# Altium project LinuxstampII.PrjPCB
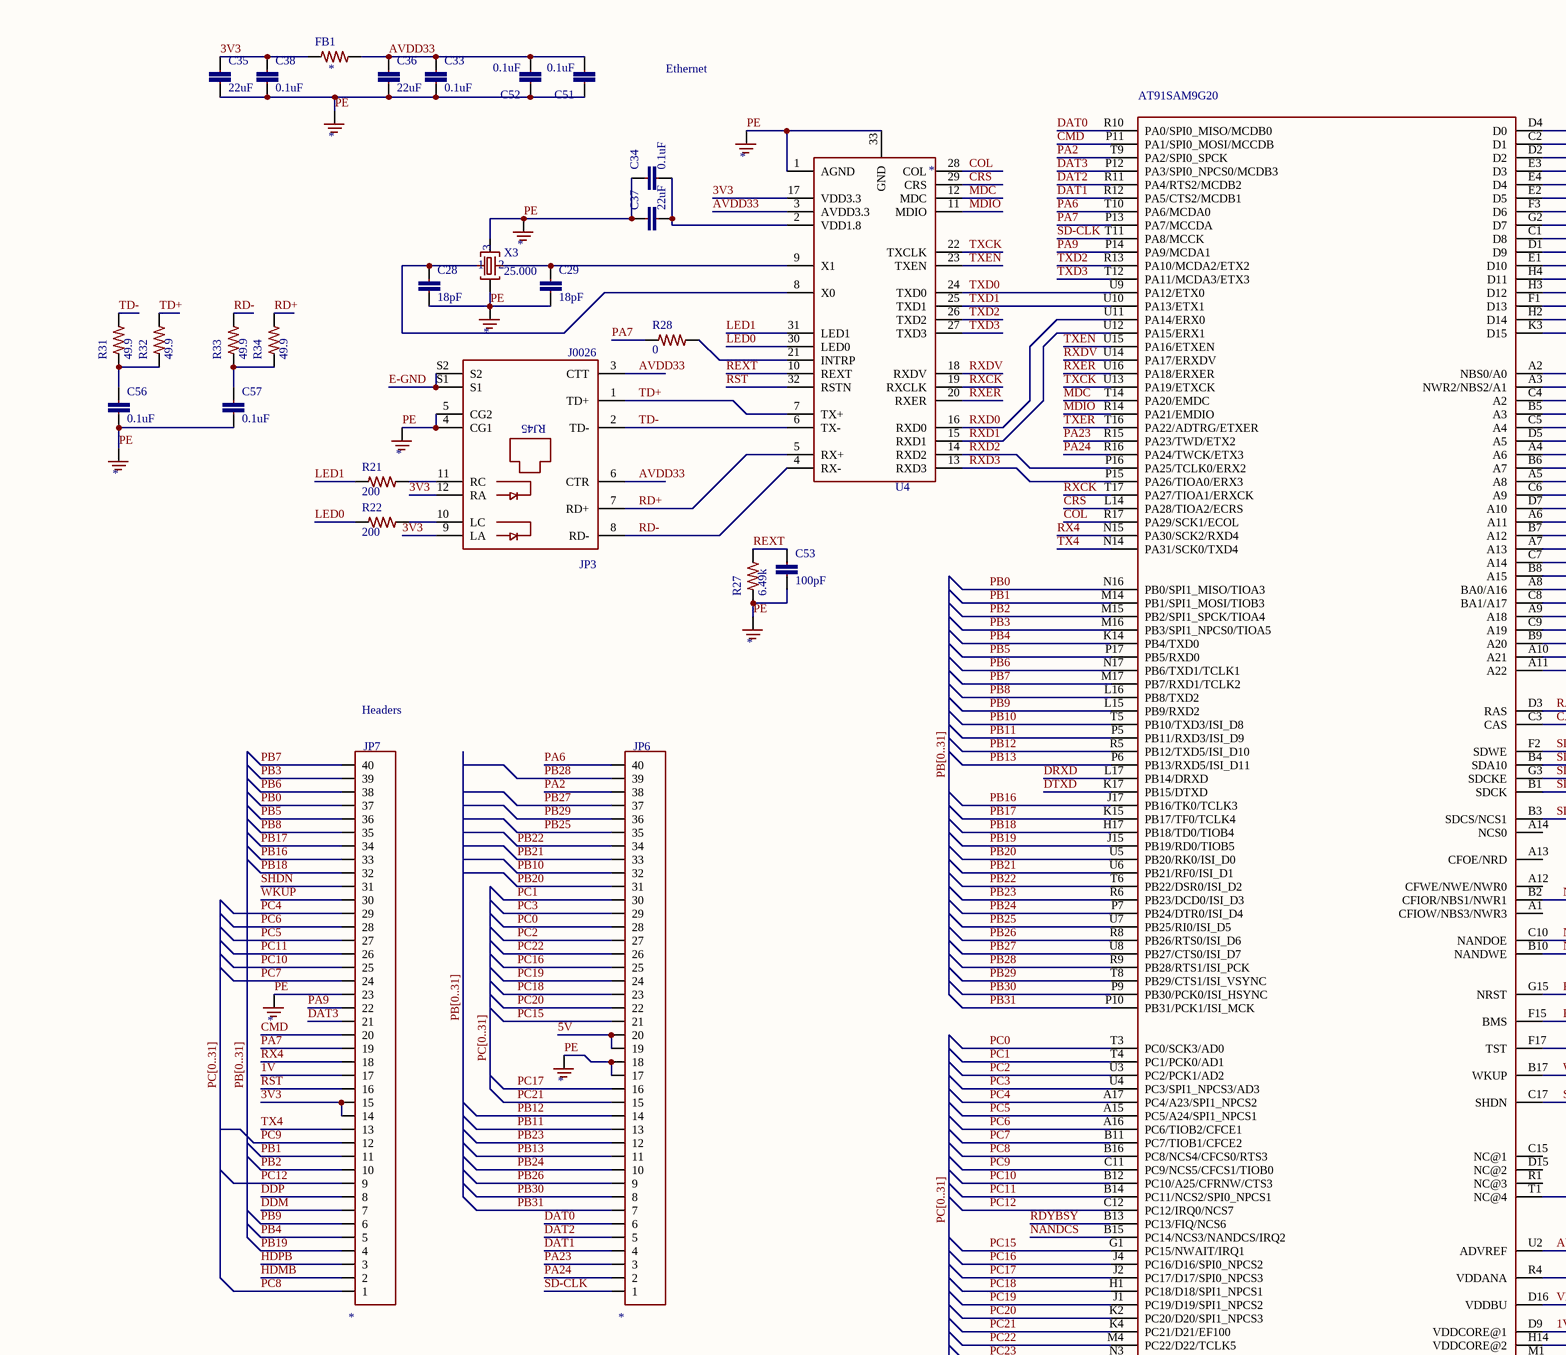
[diagram p0: ls2_101_1.SchDoc, top left]
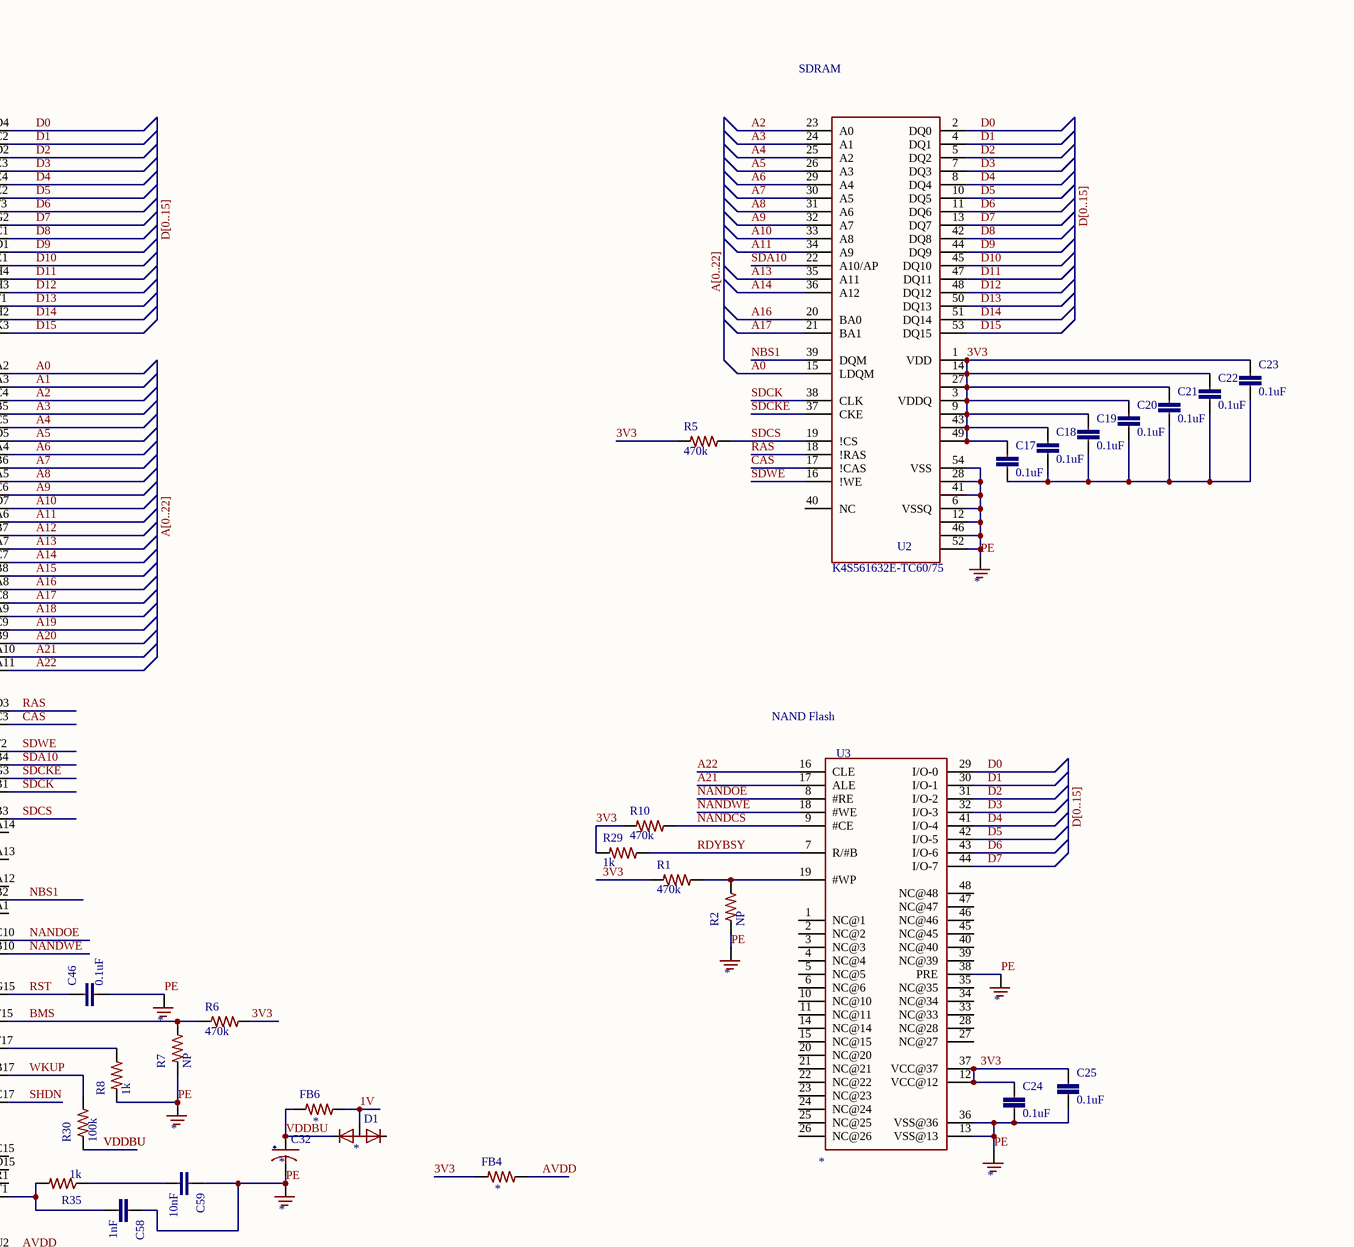
[diagram p1: ls2_101_1.SchDoc, top right]
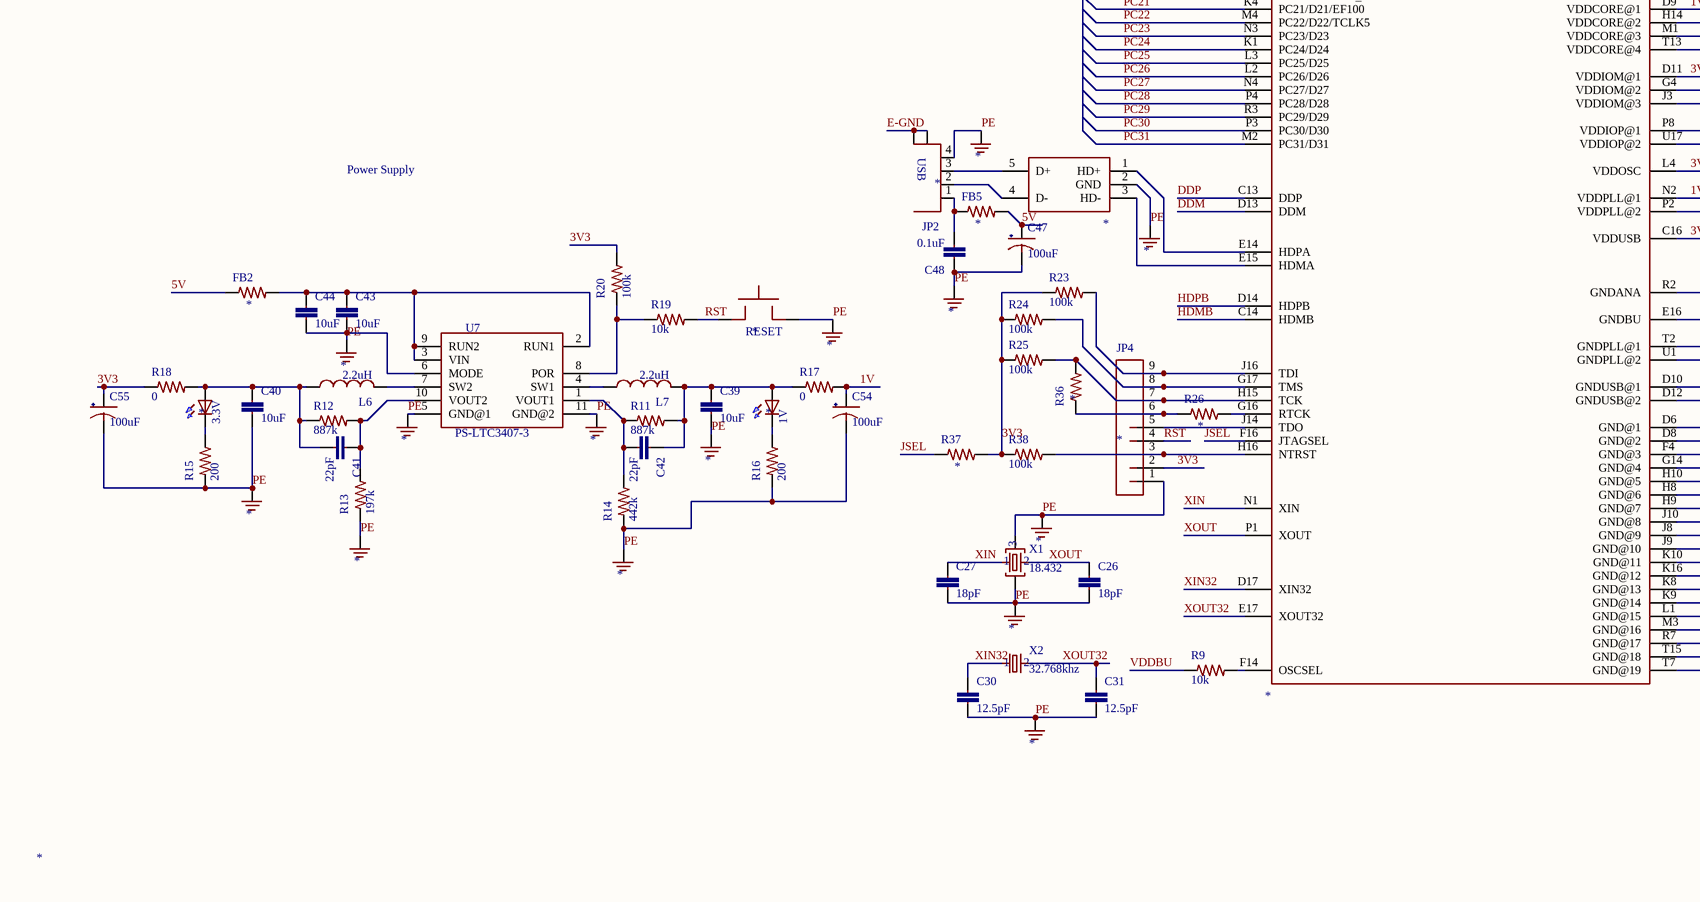
[diagram p2: ls2_101_1.SchDoc, bottom left]
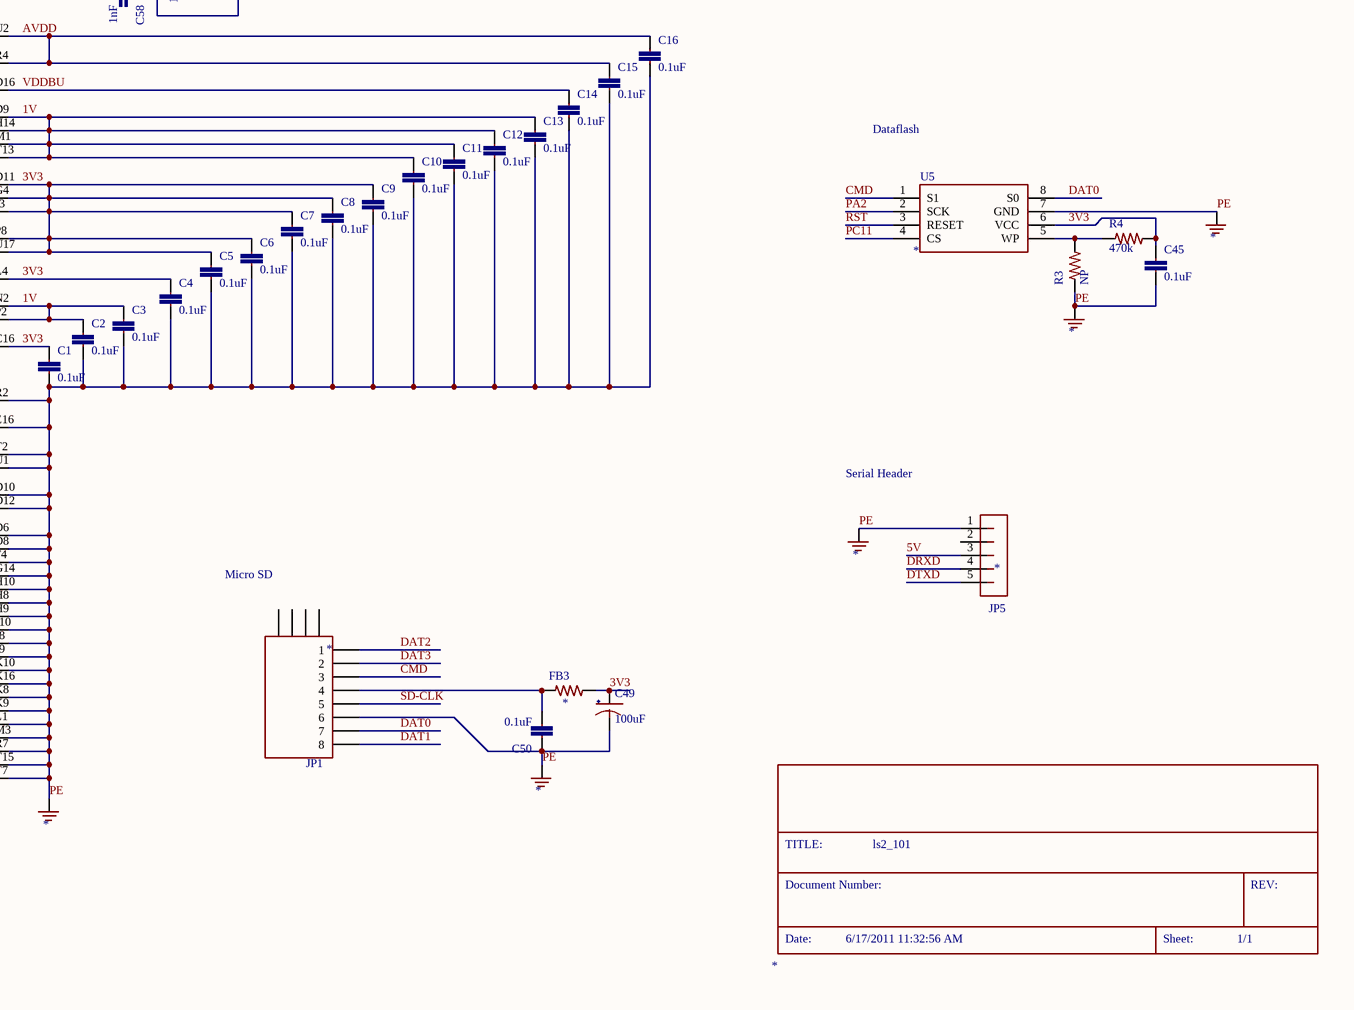
[diagram p3: ls2_101_1.SchDoc, bottom right]
1 sheet, 162 parts. Net scope: global (net labels, ports and power ports of the same name join across sheets).

## Sheet ls2_101_1.SchDoc
size 559 x 432 mm

### Parts
1V  *  [CHIP-LED0603]
3.3V  *  [CHIP-LED0603]
C1  0.1uF  [0402]
C2  0.1uF  [0402]
C3  0.1uF  [0402]
C4  0.1uF  [0402]
C5  0.1uF  [0402]
C6  0.1uF  [0402]
C7  0.1uF  [0402]
C8  0.1uF  [0402]
C9  0.1uF  [0402]
C10  0.1uF  [0402]
C11  0.1uF  [0402]
C12  0.1uF  [0402]
C13  0.1uF  [0402]
C14  0.1uF  [0402]
C15  0.1uF  [0402]
C16  0.1uF  [0402]
C17  0.1uF  [0402]
C18  0.1uF  [0402]
C19  0.1uF  [0402]
C20  0.1uF  [0402]
C21  0.1uF  [0402]
C22  0.1uF  [0402]
C23  0.1uF  [0402]
C24  0.1uF  [0402]
C25  0.1uF  [0402]
C26  18pF  [0402]
C27  18pF  [0402]
C28  18pF  [0402]
C29  18pF  [0402]
C30  12.5pF  [0402]
C31  12.5pF  [0402]
C32  *  [E3,5-8]
C33  0.1uF  [0402]
C34  0.1uF  [0402]
C35  22uF  [C0805K]
C36  22uF  [C0805K]
C37  22uF  [C0805K]
C38  0.1uF  [0402]
C39  10uF  [C0805K]
C40  10uF  [C0805K]
C41  22pF  [0402]
C42  22pF  [0402]
C43  10uF  [C0805K]
C44  10uF  [C0805K]
C45  0.1uF  [0402]
C46  0.1uF  [0402]
C47  100uF  [C/6032-28R]
C48  0.1uF  [0402]
C49  100uF  [C/6032-28R]
C50  0.1uF  [0402]
C51  0.1uF  [0402]
C52  0.1uF  [0402]
C53  100pF  [0402]
C54  100uF  [C/6032-28R]
C55  100uF  [C/6032-28R]
C56  0.1uF  [0402]
C57  0.1uF  [0402]
C58  1nF  [0402]
C59  10nF  [0402]
D1  *  [SOT23]
FB1  *  [0402]
FB2  *  [0402]
FB3  *  [0402]
FB4  *  [0402]
FB5  *  [0402]
FB6  *  [0402]
FRAME1  *  (parts A,B of 2)
JP1  *  [CON-MICRO-SD]
JP2  *  [PN87520]
JP3  J0026  [PJ-J0]
JP4  *  [MA09-1]
JP5  *  [MA05-1]
JP6  *  [CON-BERGSTACK-40]
JP7  *  [CON-BERGSTACK-40]
L6  2.2uH  [L1812]
L7  2.2uH  [L1812]
R1  470k  [0402]
R2  NP  [0402]
R3  NP  [0402]
R4  470k  [0402]
R5  470k  [0402]
R6  470k  [0402]
R7  NP  [0402]
R8  1k  [0402]
R9  10k  [0402]
R10  470k  [0402]
R11  887k  [0402]
R12  887k  [0402]
R13  197k  [0402]
R14  442k  [0402]
R15  200  [0402]
R16  200  [0402]
R17  0  [0402]
R18  0  [0402]
R19  10k  [0402]
R20  100k  [0402]
R21  200  [0402]
R22  200  [0402]
R23  100k  [0402]
R24  100k  [0402]
R25  100k  [0402]
R26  *  [0402]
R27  6.49k  [0402]
R28  0  [0402]
R29  1k  [0402]
R30  100k  [0402]
R31  49.9  [0402]
R32  49.9  [0402]
R33  49.9  [0402]
R34  49.9  [0402]
R35  1k  [0402]
R36  *  [0402]
R37  *  [0402]
R38  100k  [0402]
RESET  *  [SWITCH-6X3.5]
SUPPLY1  *
SUPPLY2  *
SUPPLY3  *
SUPPLY4  *
SUPPLY5  *
SUPPLY6  *
SUPPLY7  *
SUPPLY8  *
SUPPLY9  *
SUPPLY10  *
SUPPLY11  *
SUPPLY12  *
SUPPLY13  *
SUPPLY14  *
SUPPLY15  *
SUPPLY16  *
SUPPLY17  *
SUPPLY18  *
SUPPLY19  *
SUPPLY20  *
SUPPLY21  *
SUPPLY22  *
SUPPLY23  *
SUPPLY24  *
SUPPLY25  *
SUPPLY26  *
SUPPLY27  *
SUPPLY28  *
SUPPLY29  *
SUPPLY30  *
SUPPLY31  *
SUPPLY32  *
SUPPLY33  *
SUPPLY34  *
SUPPLY35  *
U1  *  [LFBGA-217]
U2  K4S561632E-TC60/75  [TSOP54]
U3  *  [TSOP48]
U4  *  [MLF32]
U5  *  [CASON-8]
U6  *  [SOT323-5]
U7  PS-LTC3407-3  [DFN-10]
X1  18.432  [CRYSTAL-3.2-2.5]
X2  32.768khz  [MM20SS]
X3  25.000  [CRYSTAL-3.2-2.5]

### Nets
1V: C2.1 C3.1 C10.1 C11.1 C12.1 C13.1 C54.+ D1.3(A) FB6.2 JP7.17 R17.2 U1.D9(VDDCORE@1) U1.H14(VDDCORE@2) U1.M1(VDDCORE@3) U1.N2(VDDPLL@1) U1.P2(VDDPLL@2) U1.T13(VDDCORE@4)
3V3: C1.1 C4.1 C5.1 C6.1 C7.1 C8.1 C9.1 C17.1 C18.1 C19.1 C20.1 C21.1 C22.1 C23.1 C24.1 C25.1 C35.1 C38.1 C45.1 C49.+ C55.+ FB1.1 FB3.2 FB4.1 JP3.9(LA) JP3.12(RA) JP4.2 JP7.14 JP7.15 R1.1 R4.2 R5.1 R6.2 R10.1 R18.1 R20.2 R23.1 R24.1 R25.1 R29.1 R37.2 R38.1 U1.C16(VDDUSB) U1.D11(VDDIOM@1) U1.G4(VDDIOM@2) U1.J3(VDDIOM@3) U1.L4(VDDOSC) U1.P8(VDDIOP@1) U1.U17(VDDIOP@2) U2.1(VDD) U2.3(VDDQ) U2.9(VDDQ@9) U2.14(VDD@14) U2.27(VDD@27) U2.43(VDDQ@43) U2.49(VDDQ@49) U3.12(VCC@12) U3.37(VCC@37) U4.17(VDD3.3) U5.6(VCC)
5V: C47.+ FB2.1 FB5.2 JP5.3 JP6.19 JP6.20
A0: U1.A2(NBS0/A0) U2.15(LDQM)
A1: U1.A3(NWR2/NBS2/A1)
A2: U1.C4(A2) U2.23(A0)
A3: U1.B5(A3) U2.24(A1)
A4: U1.C5(A4) U2.25(A2)
A5: U1.D5(A5) U2.26(A3)
A6: U1.A4(A6) U2.29(A4)
A7: U1.B6(A7) U2.30(A5)
A8: U1.A5(A8) U2.31(A6)
A9: U1.C6(A9) U2.32(A7)
A10: U1.D7(A10) U2.33(A8)  [also labelled A[0..22]]
A11: U1.A6(A11) U2.34(A9)
A12: U1.B7(A12)
A13: U1.A7(A13) U2.35(A11)
A14: U1.C7(A14) U2.36(A12)
A15: U1.B8(A15)
A16: U1.A8(BA0/A16) U2.20(BA0)
A17: U1.C8(BA1/A17) U2.21(BA1)
A18: U1.A9(A18)
A19: U1.C9(A19)
A20: U1.B9(A20)
A21: U1.A10(A21) U3.17(ALE)
A22: U1.A11(A22) U3.16(CLE)
AVDD: C15.1 C16.1 FB4.2 U1.R4(VDDANA) U1.U2(ADVREF)
AVDD33: C33.1 C36.1 C51.2 C52.2 FB1.2 JP3.3(CTT) JP3.6(CTR) U4.3(AVDD3.3)
BMS: R6.1 R7.2 U1.F15(BMS)
CAS: U1.C3(CAS) U2.17(!CAS)
CMD: JP1.3 JP7.20 U1.P11(PA1/SPI0_MOSI/MCCDB) U5.1(S1)
COL: U1.R17(PA29/SCK1/ECOL) U4.28(COL)
CRS: U1.L14(PA28/TIOA2/ECRS) U4.29(CRS)
D0: U1.D4(D0) U2.2(DQ0) U3.29(I/O-0)
D1: U1.C2(D1) U2.4(DQ1) U3.30(I/O-1)
D2: U1.D2 U1.E2(D5) U1.F3(D6) U2.5(DQ2) U2.10(DQ5) U2.11(DQ6) U3.31(I/O-2) U3.42(I/O-5) U3.43(I/O-6)  [also labelled D5, D6, D[0..15]]
D3: U1.E3(D3) U2.7(DQ3) U3.32(I/O-3)
D4: U1.E4(D4) U2.8(DQ4) U3.41(I/O-4)
D7: U1.G2(D7) U2.13(DQ7) U3.44(I/O-7)
D8: U1.C1(D8) U2.42(DQ8)
D9: U1.D1(D9) U2.44(DQ9)
D10: U1.E1(D10) U2.45(DQ10)
D11: U1.H4(D11) U2.47(DQ11)
D12: U1.H3(D12) U2.48(DQ12)
D13: U1.F1(D13) U2.50(DQ13)
D14: U1.H2(D14) U2.51(DQ14)
D15: U1.K3(D15) U2.53(DQ15)
DAT0: JP1.7 JP6.6 U1.R10(PA0/SPI0_MISO/MCDB0) U5.8(S0)
DAT1: JP1.8 JP6.4 U1.R12(PA5/CTS2/MCDB1)
DAT2: JP1.1 JP6.5 U1.R11(PA4/RTS2/MCDB2)
DAT3: JP1.2 JP7.21 U1.P12(PA3/SPI0_NPCS0/MCDB3)
DDM: JP7.7 U1.D13(DDM)
DDP: JP7.8 U1.C13(DDP)
DRXD: JP5.4 U1.L17(PB14/DRXD)
DTXD: JP5.5 U1.K17(PB15/DTXD)
E-GND: JP2.G1 JP2.G2 JP3.S1 JP3.S2
HDMB: JP7.2 U1.C14(HDMB)
HDPB: JP7.3 U1.D14(HDPB)
JSEL: R37.1 U1.F16(JTAGSEL)
LED0: R22.1 U4.30(LED0)
LED1: R21.1 U4.31(LED1)
MDC: U1.T14(PA20/EMDC) U4.12(MDC)
MDIO: U1.R14(PA21/EMDIO) U4.11(MDIO)
NANDCS: R10.2 U1.B15(PC14/NCS3/NANDCS/IRQ2) U3.9(#CE)
NANDOE: U1.C10(NANDOE) U3.8(#RE)
NANDWE: U1.B10(NANDWE) U3.18(#WE)
NBS1: U1.B2(CFIOR/NBS1/NWR1) U2.39(DQM)
PA2: JP6.38 U1.T9(PA2/SPI0_SPCK) U5.2(SCK)
PA6: JP6.40 U1.T10(PA6/MCDA0)
PA7: JP7.19 R28.1 U1.P13(PA7/MCCDA)
PA9: JP7.22 U1.P14(PA9/MCDA1)
PA23: JP6.3 U1.R15(PA23/TWD/ETX2)
PA24: JP6.2 U1.R16(PA24/TWCK/ETX3)
PB0: JP7.37 U1.N16(PB0/SPI1_MISO/TIOA3)
PB1: JP7.11 U1.M14(PB1/SPI1_MOSI/TIOB3)
PB2: JP7.10 U1.M15(PB2/SPI1_SPCK/TIOA4)
PB3: JP7.39 U1.M16(PB3/SPI1_NPCS0/TIOA5)
PB4: JP7.5 U1.K14(PB4/TXD0)
PB5: JP7.36 U1.P17(PB5/RXD0)
PB6: JP7.38 U1.N17(PB6/TXD1/TCLK1)
PB7: JP7.40 U1.M17(PB7/RXD1/TCLK2)
PB8: JP7.35 U1.L16(PB8/TXD2)
PB9: JP7.6 U1.L15(PB9/RXD2)
PB10: JP6.32 U1.T5(PB10/TXD3/ISI_D8)
PB11: JP6.13 U1.P5(PB11/RXD3/ISI_D9)
PB12: JP6.14 U1.R5(PB12/TXD5/ISI_D10)
PB13: JP6.11 U1.P6(PB13/RXD5/ISI_D11)
PB16: JP7.33 U1.J17(PB16/TK0/TCLK3)
PB17: JP7.34 U1.K15(PB17/TF0/TCLK4)
PB18: JP7.32 U1.H17(PB18/TD0/TIOB4)
PB19: JP7.4 U1.J15(PB19/RD0/TIOB5)
PB20: JP6.31 U1.U5(PB20/RK0/ISI_D0)
PB21: JP6.33 U1.U6(PB21/RF0/ISI_D1)
PB22: JP6.34 U1.T6(PB22/DSR0/ISI_D2)
PB23: JP6.12 U1.R6(PB23/DCD0/ISI_D3)
PB24: JP6.10 U1.P7(PB24/DTR0/ISI_D4)
PB25: JP6.35 U1.U7(PB25/RI0/ISI_D5)
PB26: JP6.9 U1.R8(PB26/RTS0/ISI_D6)
PB27: JP6.37 U1.U8(PB27/CTS0/ISI_D7)
PB28: JP6.39 U1.R9(PB28/RTS1/ISI_PCK)
PB29: JP6.36 U1.T8(PB29/CTS1/ISI_VSYNC)
PB30: JP6.8 U1.P9(PB30/PCK0/ISI_HSYNC)
PB31: JP6.7 U1.P10(PB31/PCK1/ISI_MCK)
PC0: JP6.28 U1.T3(PC0/SCK3/AD0)
PC1: JP6.30 U1.T4(PC1/PCK0/AD1)
PC2: JP6.27 U1.U3(PC2/PCK1/AD2)
PC3: JP6.29 U1.U4(PC3/SPI1_NPCS3/AD3)
PC4: JP7.29 U1.A17(PC4/A23/SPI1_NPCS2)
PC5: JP7.27 U1.A15(PC5/A24/SPI1_NPCS1)
PC6: JP7.28 U1.A16(PC6/TIOB2/CFCE1)
PC7: JP7.24 U1.B11(PC7/TIOB1/CFCE2)
PC8: JP7.1 U1.B16(PC8/NCS4/CFCS0/RTS3)
PC9: JP7.12 U1.C11(PC9/NCS5/CFCS1/TIOB0)
PC10: JP7.25 U1.B12(PC10/A25/CFRNW/CTS3)
PC11: JP7.26 U1.B14(PC11/NCS2/SPI0_NPCS1) U5.4(CS)
PC12: JP7.9 U1.C12(PC12/IRQ0/NCS7)
PC15: JP6.21 U1.G1(PC15/NWAIT/IRQ1)
PC16: JP6.25 U1.J4(PC16/D16/SPI0_NPCS2)
PC17: JP6.16 U1.J2(PC17/D17/SPI0_NPCS3)
PC18: JP6.23 U1.H1(PC18/D18/SPI1_NPCS1)
PC19: JP6.24 U1.J1(PC19/D19/SPI1_NPCS2)
PC20: JP6.22 U1.K2(PC20/D20/SPI1_NPCS3)
PC21: JP6.15 U1.K4(PC21/D21/EF100)
PC22: JP6.26 U1.M4(PC22/D22/TCLK5)
PC23: U1.N3(PC23/D23)
PC24: U1.K1(PC24/D24)
PC25: U1.L3(PC25/D25)
PC26: U1.L2(PC26/D26)
PC27: U1.N4(PC27/D27)
PC28: U1.P4(PC28/D28)
PC29: U1.R3(PC29/D29)
PC30: U1.P3(PC30/D30)
PC31: U1.M2(PC31/D31)
PE: C1.2 C2.2 C3.2 C4.2 C5.2 C6.2 C7.2 C8.2 C9.2 C10.2 C11.2 C12.2 C13.2 C14.2 C15.2 C16.2 C24.2 C25.2 C26.2 C27.2 C28.2 C29.2 C30.2 C31.2 C32.- C33.2 C34.1 C35.2 C36.2 C37.1 C38.2 C39.2 C40.2 C43.2 C44.2 C45.2 C46.2 C47.- C48.1 C49.- C50.1 C51.1 C52.1 C53.2 C54.- C55.- C56.2 C57.2 C58.1 C59.1 JP1.6 JP2.4 JP3.4(CG1) JP3.5(CG2) JP4.1 JP5.1 JP6.17 JP6.18 JP7.23 R2.1 R3.1 R7.1 R8.1 R13.1 R14.1 R15.1 R16.1 R27.1 RESET.2 SUPPLY1.0(PE) SUPPLY2.0(PE) SUPPLY3.0(PE) SUPPLY4.0(PE) SUPPLY5.0(PE) SUPPLY6.0(PE) SUPPLY7.0(PE) SUPPLY8.0(PE) SUPPLY9.0(PE) SUPPLY10.0(PE) SUPPLY11.0(PE) SUPPLY12.0(PE) SUPPLY13.0(PE) SUPPLY14.0(PE) SUPPLY15.0(PE) SUPPLY16.0(PE) SUPPLY17.0(PE) SUPPLY18.0(PE) SUPPLY19.0(PE) SUPPLY20.0(PE) SUPPLY21.0(PE) SUPPLY22.0(PE) SUPPLY23.0(PE) SUPPLY24.0(PE) SUPPLY25.0(PE) SUPPLY26.0(PE) SUPPLY27.0(PE) SUPPLY28.0(PE) SUPPLY29.0(PE) SUPPLY30.0(PE) SUPPLY31.0(PE) SUPPLY32.0(PE) SUPPLY33.0(PE) SUPPLY34.0(PE) SUPPLY35.0(PE) U1.D6(GND@1) U1.D8(GND@2) U1.D10(GNDUSB@1) U1.D12(GNDUSB@2) U1.E16(GNDBU) U1.F4(GND@3) U1.G14(GND@4) U1.H8(GND@6) U1.H9(GND@7) U1.H10(GND@5) U1.J8(GND@9) U1.J9(GND@10) U1.J10(GND@8) U1.K8(GND@13) U1.K9(GND@14) U1.K10(GND@11) U1.K16(GND@12) U1.L1(GND@15) U1.M3(GND@16) U1.R2(GNDANA) U1.R7(GND@17) U1.T2(GNDPLL@1) U1.T7(GND@19) U1.T15(GND@18) U1.U1(GNDPLL@2) U2.6(VSSQ) U2.12(VSSQ@12) U2.28(VSS@28) U2.41(VSS@41) U2.46(VSSQ@46) U2.52(VSSQ@52) U2.54(VSS) U3.13(VSS@13) U3.36(VSS@36) U3.38(PRE) U4.1(AGND) U4.33(GND) U5.7(GND) U6.2(GND) U7.5(GND@1) U7.6(MODE) U7.11(GND@2) X1.2(GND@1) X1.4(GND@2) X3.2(GND@1) X3.4(GND@2)
RAS: U1.D3(RAS) U2.18(!RAS)
RD+: JP3.7(RD+) R34.2 U4.5(RX+)
RD-: JP3.8(RD-) R33.2 U4.4(RX-)
RDYBSY: R29.2 U1.B13(PC13/FIQ/NCS6) U3.7(R/#B)
REXT: C53.1 R27.2 U4.10(REXT)
RST: C46.1 JP4.4 JP7.16 R19.2 RESET.1 U1.G15(NRST) U4.32(RSTN) U5.3(RESET)
RX4: JP7.18 U1.N15(PA30/SCK2/RXD4)
RXCK: U1.T17(PA27/TIOA1/ERXCK) U4.19(RXCLK)
RXD0: U1.U11(PA14/ERX0) U4.16(RXD0)
RXD1: U1.U12(PA15/ERX1) U4.15(RXD1)
RXD2: U1.P16(PA25/TCLK0/ERX2) U4.14(RXD2)
RXD3: U1.P15(PA26/TIOA0/ERX3) U4.13(RXD3)
RXDV: U1.U14(PA17/ERXDV) U4.18(RXDV)
RXER: U1.U16(PA18/ERXER) U4.20(RXER)
SD-CLK: JP1.5 JP6.1 U1.T11(PA8/MCCK)
SDA10: U1.B4(SDA10) U2.22(A10/AP)
SDCK: U1.B1(SDCK) U2.38(CLK)
SDCKE: U1.G3(SDCKE) U2.37(CKE)
SDCS: R5.2 U1.B3(SDCS/NCS1) U2.19(!CS)
SDWE: U1.F2(SDWE) U2.16(!WE)
SHDN: JP7.31 U1.C17(SHDN)
TD+: JP3.1(TD+) R32.2 U4.7(TX+)
TD-: JP3.2(TD-) R31.2 U4.6(TX-)
TX4: JP7.13 U1.N14(PA31/SCK0/TXD4)
TXCK: U1.U13(PA19/ETXCK) U4.22(TXCLK)
TXD0: U1.U9(PA12/ETX0) U4.24(TXD0)
TXD1: U1.U10(PA13/ETX1) U4.25(TXD1)
TXD2: U1.R13(PA10/MCDA2/ETX2) U4.26(TXD2)
TXD3: U1.T12(PA11/MCDA3/ETX3) U4.27(TXD3)
TXEN: U1.U15(PA16/ETXEN) U4.23(TXEN)
TXER: U1.T16(PA22/ADTRG/ETXER)
VDDBU: C14.1 C32.+ D1.1(K1) FB6.1 R9.1 R30.1 U1.D16(VDDBU)
WKUP: JP7.30 R30.2 U1.B17(WKUP)
XIN: C27.1 U1.N1(XIN) X1.1(C1)
XIN32: C30.1 U1.D17(XIN32) X2.1
XOUT: C26.1 U1.P1(XOUT) X1.3(C2)
XOUT32: C31.1 U1.E17(XOUT32) X2.4
Net1V_A: 1V.A C39.1 C42.1 L7.2 R11.2 R17.1
Net1V_C: 1V.C R16.2
Net3.3V_A: 3.3V.A C40.1 C41.2 L6.1 R12.1 R18.2
Net3.3V_C: 3.3V.C R15.2
NetC17_2: C17.2 C18.2 C19.2 C20.2 C21.2 C22.2 C23.2
NetC28_1: C28.1 U4.8(X0) X3.1(C1)
NetC29_1: C29.1 U4.9(X1) X3.3(C2)
NetC34_2: C34.2 C37.2 U4.2(VDD1.8)
NetC41_1: C41.1 R12.2 R13.2 U7.10(VOUT2)
NetC42_2: C42.2 R11.1 R14.2 U7.1(VOUT1)
NetC43_1: C43.1 C44.1 FB2.2 U7.2(RUN1) U7.3(VIN) U7.9(RUN2)
NetC48_2: C48.2 FB5.1 JP2.1
NetC50_2: C50.2 FB3.1 JP1.4
NetC56_1: C56.1 R31.1 R32.1
NetC57_1: C57.1 R33.1 R34.1
NetC58_2: C58.2 R35.2 U1.T1(NC@4)
NetC59_2: C59.2 R35.1
NetJP2_2: JP2.2 U6.4(D-)
NetJP2_3: JP2.3 U6.5(D+)
NetJP3_10: JP3.10(LC) R22.2
NetJP3_11: JP3.11(RC) R21.2
NetJP4_3: JP4.3 R38.2 U1.H16(NTRST)
NetJP4_5: JP4.5 U1.J14(TDO)
NetJP4_6: JP4.6 R26.1 R36.1
NetJP4_7: JP4.7 R25.2 R36.2 U1.H15(TCK)
NetJP4_8: JP4.8 R24.2 U1.G17(TMS)
NetJP4_9: JP4.9 R23.2 U1.J16(TDI)
NetL6_2: L6.2 U7.7(SW2)
NetL7_1: L7.1 U7.4(SW1)
NetR1_2: R1.2 R2.2 U3.19(#WP)
NetR3_2: R3.2 R4.1 U5.5(WP)
NetR8_2: R8.2 U1.F17(TST)
NetR9_2: R9.2 U1.F14(OSCSEL)
NetR19_1: R19.1 R20.1 U7.8(POR)
NetR26_2: R26.2 U1.G16(RTCK)
NetR28_2: R28.2 U4.21(INTRP)
NetU1_E14: U1.E14(HDPA) U6.1(HD+)
NetU1_E15: U1.E15(HDMA) U6.3(HD-)

Not connected (* = marked no-connect by the designer): D1 2(K2); JP1 M1 M2 M3 M4; JP5 2; U1 A1(CFIOW/NBS3/NWR3) A12(CFWE/NWE/NWR0) A13(CFOE/NRD) A14(NCS0) C15(NC@1) D15(NC@2) R1(NC@3); U2 40(NC); U3 1(NC@1) 2(NC@2) 3(NC@3) 4(NC@4) 5(NC@5) 6(NC@6) 10(NC@10) 11(NC@11) 14(NC@14) 15(NC@15) 20(NC@20) 21(NC@21) 22(NC@22) 23(NC@23) 24(NC@24) 25(NC@25) 26(NC@26) 27(NC@27) 28(NC@28) 33(NC@33) 34(NC@34) 35(NC@35) 39(NC@39) 40(NC@40) 45(NC@45) 46(NC@46) 47(NC@47) 48(NC@48)

### Buses and harness runs
bus A[0..22]
bus PB[0..31]
bus PC[0..31]

### Notes on the sheet
- Ethernet
- SDRAM
- (near JP7) Headers
- (near U3) NAND Flash
- Dataflash
- Power Supply
- Serial Header
- Micro SD
- (in symbol FRAME_C_L, part B) TITLE:; ls2_101; Document Number:; REV:; Date:; 6/17/2011 11:32:56 AM; Sheet:; 1/1
- (in symbol J0026) RJ45
- (in symbol PN87520) USB

### Library data of the parts
1V 3.3V = LEDCHIP-LED0603
C1-C31 C33 C34 C38 C41 C42 C45 C46 C48 C50-C53 C56-C59 = C0402
C32 = CPOL-USE3.5-8
C35-C37 C39 C40 C43 C44 = C-EUC0805K
C47 C49 C54 C55 = CPOL-USC/6032-28R
D1 = DIODE-2CA
FB1-FB6 R1-R38 = R0402
FRAME1 = FRAME_C_L
JP1 = CON-SD
JP2 = PN87520
JP4 = MA09-1
JP5 = MA05-1
JP6 JP7 = CON-FCI-40
L6 L7 = L-USL1812
RESET = SWITCH-PUSHBUTTON-6X3.5
SUPPLY1-SUPPLY35 = PE
U1 = AT91SAM9G20
U3 = IC-X8-NAND
U4 = IC-PHY-KSZ8041-NL
U5 = DATAFLASH-8
U6 = USBDF01W5
X1 X3 = CRYSTAL-3.2-2.5
X2 = CRYTALMM20SS